# EAGLE design Lavadora (EAGLE 9.6.2)
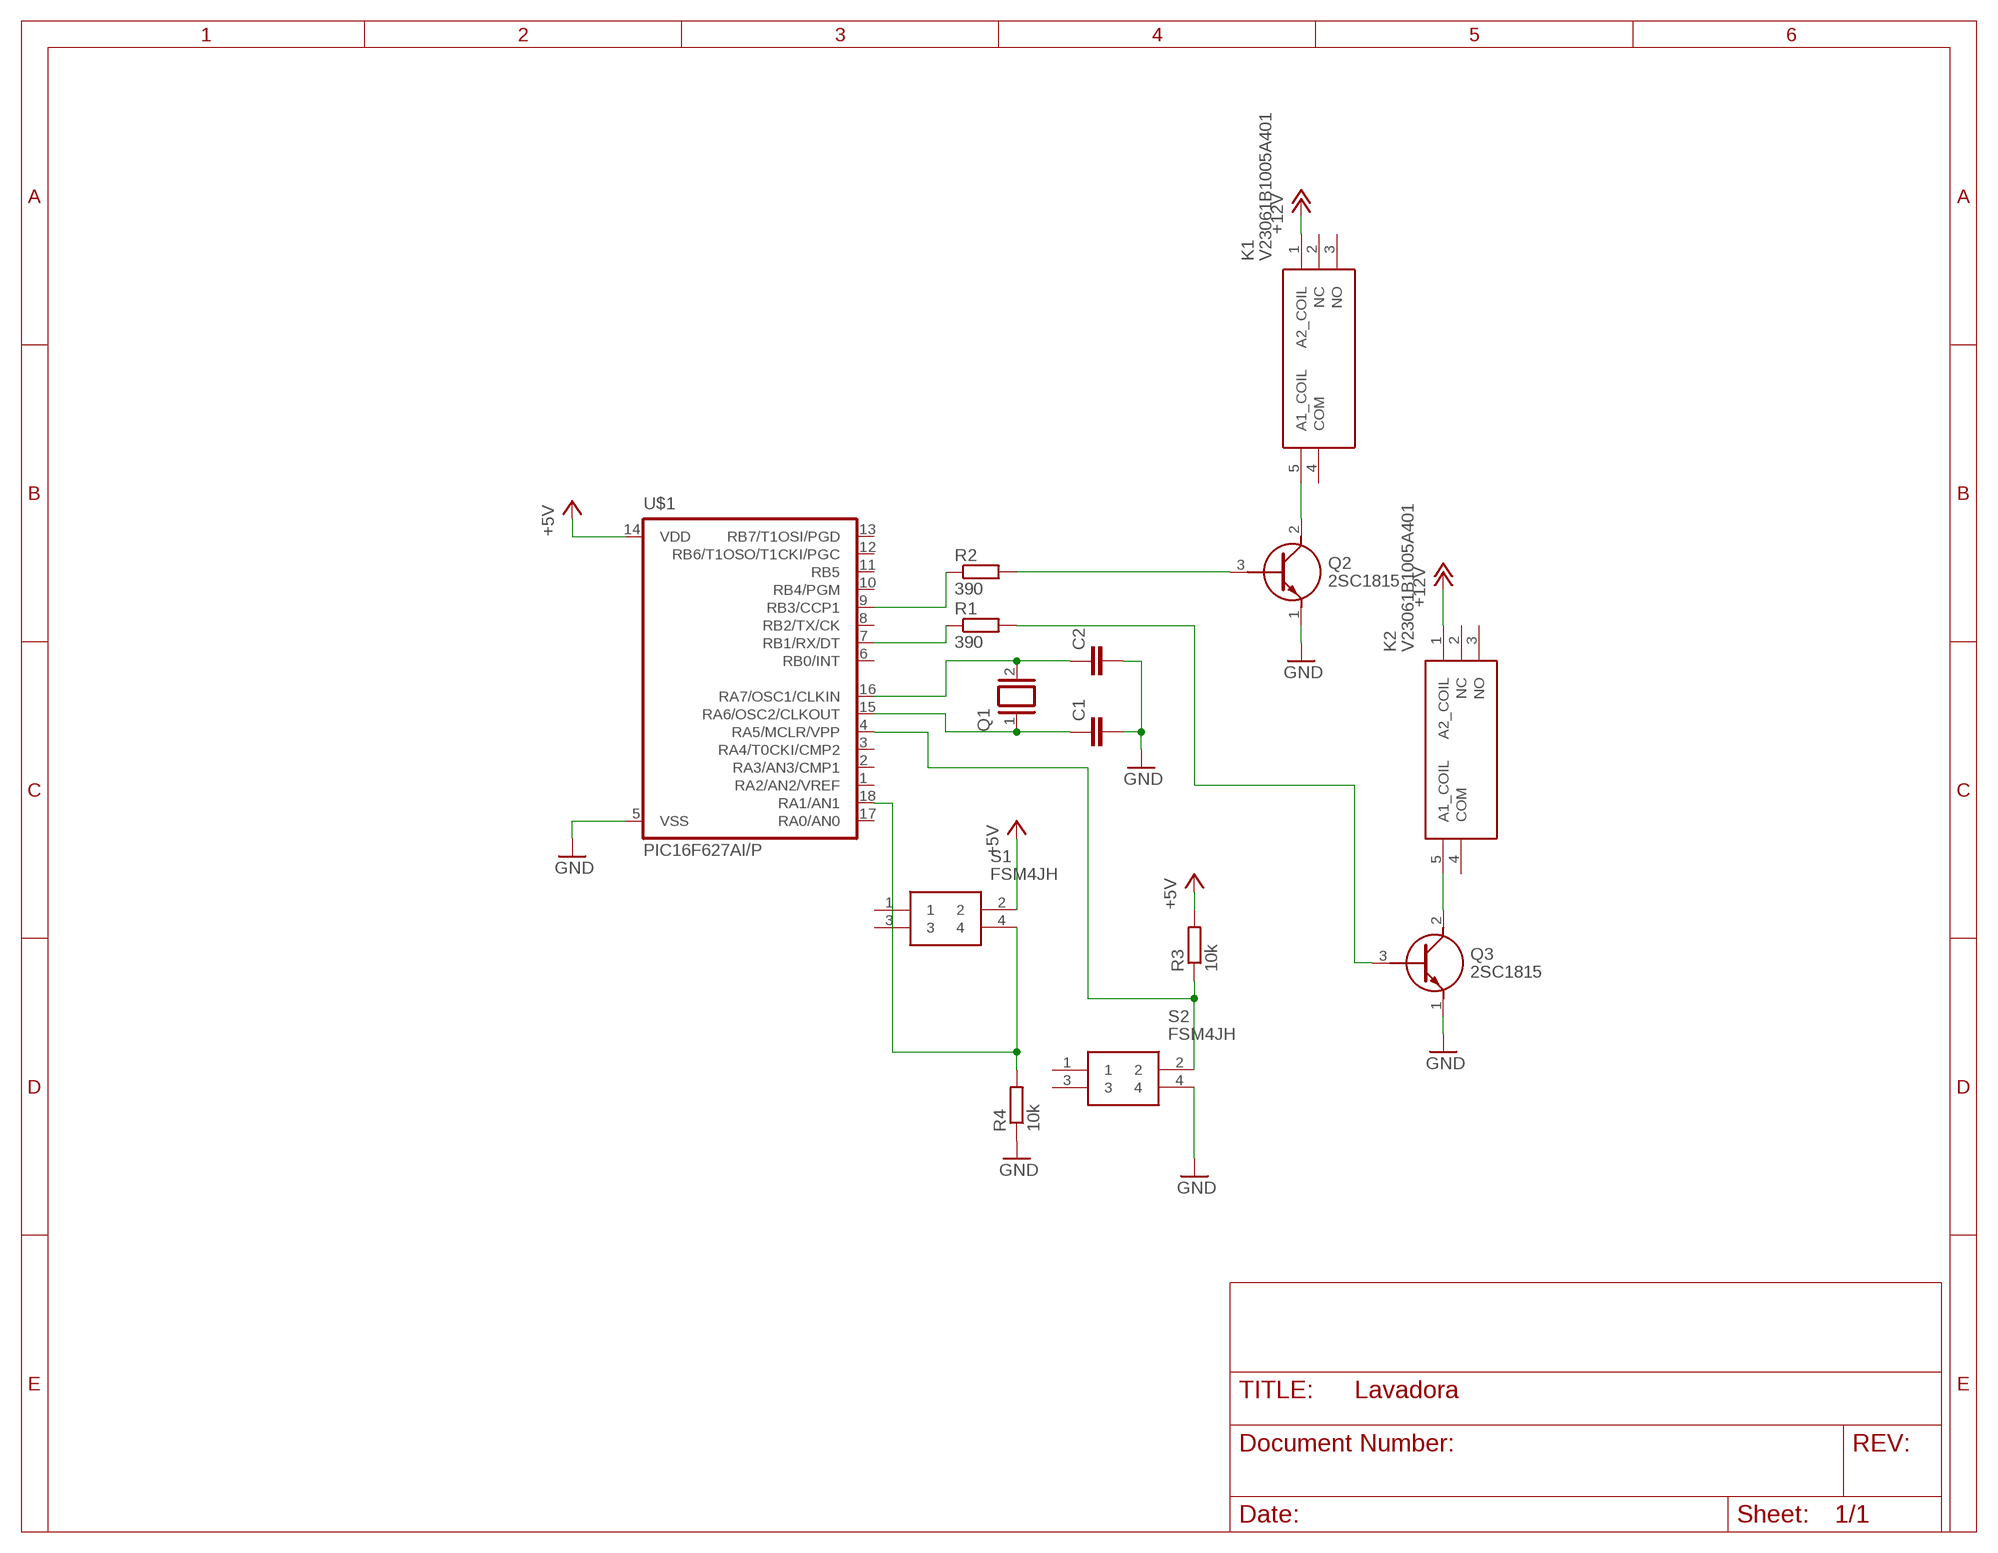
[diagram p0: schematic, sheet 1]

## Parts
C1  C-EU025-025X050  [C025-025X050]
C2  C-EU025-025X050  [C025-025X050]
K1  V23061B1005A401  [V23061B1005A401]
K2  V23061B1005A401  [V23061B1005A401]
Q1  XTAL  [Q]
Q2  2SC1815  [CS_TO-92]
Q3  2SC1815  [CS_TO-92]
R1  390  R-EU_0207/10  [0207/10]
R2  390  R-EU_0207/10  [0207/10]
R3  10k  R-EU_0207/10  [0207/10]
R4  10k  R-EU_0207/10  [0207/10]
S1  FSM4JH  [FSM4JH]
S2  FSM4JH  [FSM4JH]
U$1  PIC16F627AI/P  [DIL18]

## Nets
+5V: R3.2 S1.2 U$1.14(VDD)
+12V: K1.1(A2_COIL) K2.1(A2_COIL)
GND: C1.2 C2.2 Q2.1(E) Q3.1(E) R4.1 S2.4 U$1.5(VSS)
N$1: C1.1 Q1.1 U$1.15(RA6/OSC2/CLKOUT)
N$2: C2.1 Q1.2 U$1.16(RA7/OSC1/CLKIN)
N$3: R1.1 U$1.7(RB1/RX/DT)
N$4: R2.1 U$1.9(RB3/CCP1)
N$5: Q2.3(B) R2.2
N$6: K1.5(A1_COIL) Q2.2(C)
N$7: K2.5(A1_COIL) Q3.2(C)
N$8: Q3.3(B) R1.2
N$9: R3.1 S2.2 U$1.4(RA5/MCLR/VPP)
N$10: R4.2 S1.4 U$1.18(RA1/AN1)
Unconnected: K1.2(NC) K1.3(NO) K1.4(COM) K2.2(NC) K2.3(NO) K2.4(COM) S1.1 S1.3 S2.1 S2.3 U$1.1(RA2/AN2/VREF) U$1.2(RA3/AN3/CMP1) U$1.3(RA4/T0CKI/CMP2) U$1.6(RB0/INT) U$1.8(RB2/TX/CK) U$1.10(RB4/PGM) U$1.11(RB5) U$1.12(RB6/T1OSO/T1CKI/PGC) U$1.13(RB7/T1OSI/PGD) U$1.17(RA0/AN0)

## Library data of the parts
C1 C2 = rcl:C-EU: CAPACITOR, European symbol; SPICEPREFIX: C
K1 K2 = SamacSys_Parts:V23061B1005A401: RELAY 12VDC Source: Datasheet <https://componentsearchengine.com/Datasheets/1/V23061B1005A401.pdf>; DESCRIPTION: RELAY 12VDC; HEIGHT: mm; MANUFACTURER_NAME: TE Connectivity; MANUFACTURER_PART_NUMBER: V23061B1005A401; MOUSER_PART_NUMBER: 655-V23061B1005A401; MOUSER_PRICE-STOCK: https://www.mouser.com/Search/Refine.aspx?Keyword=655-V23061B1005A401
Q1 = special:XTAL: CRYSTAL
Q2 Q3 = 2SC1815:2SC1815: Bipolar Transistors - BJT 60Vcbo 50Vceo 5.0V 150mA 400mA 400mW Source: Datasheet <https://componentsearchengine.com/Datasheets/1/2SC1815.pdf>; DESCRIPTION: Bipolar Transistors - BJT 60Vcbo 50Vceo 5.0V 150mA 400mA 400mW; HEIGHT: mm; MANUFACTURER_NAME: Central Semiconductor; MANUFACTURER_PART_NUMBER: 2SC1815; MOUSER_PART_NUMBER: 610-2SC1815; MOUSER_PRICE-STOCK: https://www.mouser.com/Search/Refine.aspx?Keyword=610-2SC1815
R1-R4 = rcl:R-EU_: RESISTOR, European symbol; SPICEPREFIX: R
S1 S2 = FSM4JH:FSM4JH: 6x6mm tactile switch,5mm H 1.6N Black Button Tactile Switch, SPST-NO 50 mA@ 24 V dc 1.4mm Source: Datasheet <http://www.te.com/commerce/DocumentDelivery/DDEController?Action=showdoc&DocId=Customer Drawing1825910C9pdfEnglishENG_CD_1825910_C9.pdf1825910-6>; DESCRIPTION: 6x6mm tactile switch,5mm H 1.6N Black Button Tactile Switch, SPST-NO 50 mA@ 24 V dc 1.4mm; HEIGHT: mm; MANUFACTURER_NAME: TE Connectivity; MANUFACTURER_PART_NUMBER: FSM4JH; MOUSER_PART_NUMBER: 506-FSM4JH; MOUSER_PRICE-STOCK: https://www.mouser.co.uk/ProductDetail/TE-Connectivity-Alcoswitch/FSM4JH?qs=g%252BEszo6zu8OwVWrHD2r3Rw%3D%3D
U$1 = microchip-4:PIC16F627*: MICROCONTROLLER PIC16F627(A) 16 I/O One 16-bit timer (TMR0) Two 8-bit timer (TMR0) Two comparators USART CCP/PWM Precision 4 MHz internal oscillator 1k Program Flash memory 224 bytes SRAM 128 bytes EEPROM

## Board
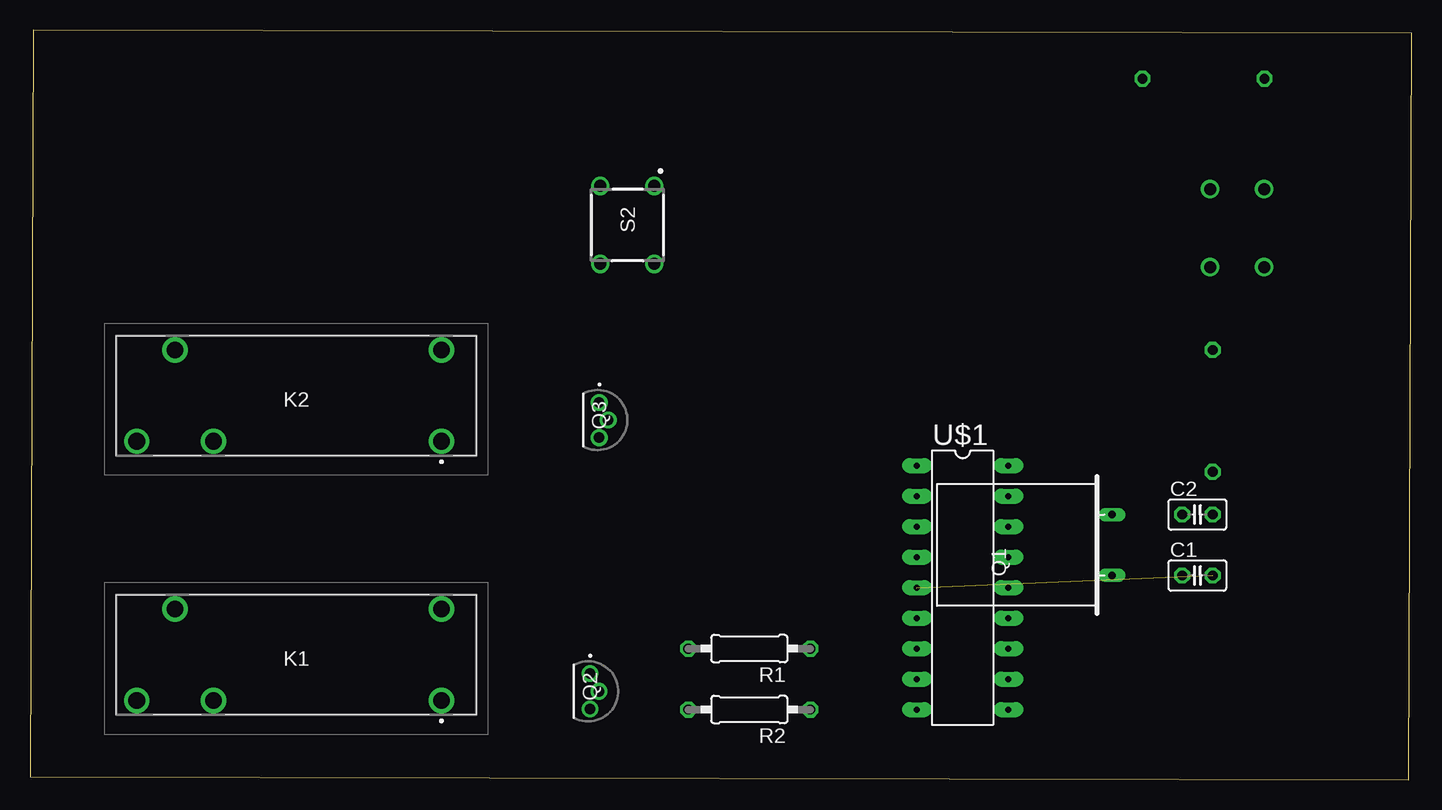
[diagram p1: board, top side]
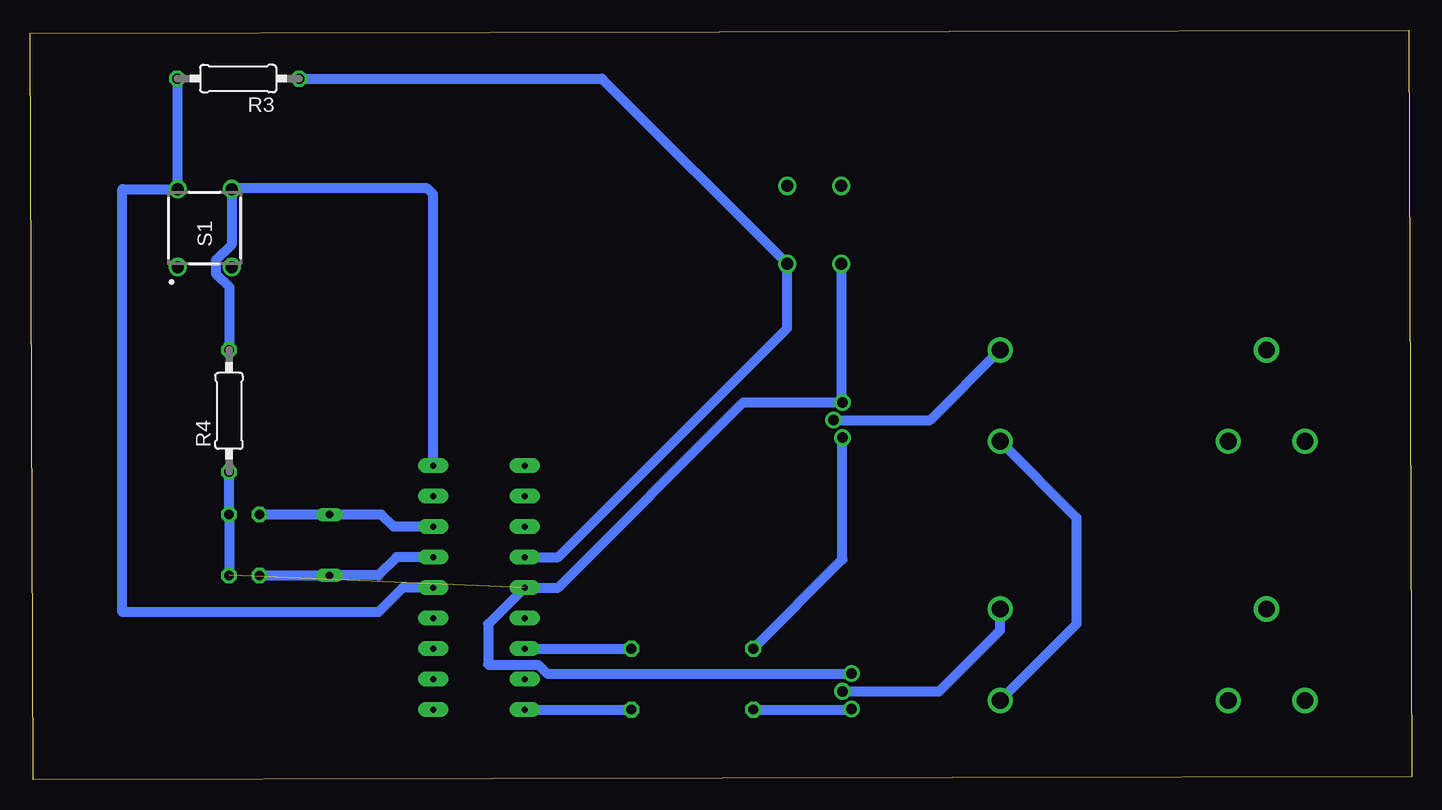
[diagram p2: board, bottom side, seen from below]

Size 115.14 x 62.47 mm. Coordinates in mm from the lower left corner, seen from the top.
Outline: 0,0.25 114.88,0 115.14,62.22 0.25,62.47 0,0.25
Copper layers (1*16): Top 0.035mm / dielectric 1.5mm / Bottom 0.035mm
Design rules "default": minimum track width 6mil, minimum drill 0.35mm, track to track 6mil, track to pad 6mil, pad to pad 6mil, via to via 6mil, smd to smd 6mil, copper to edge 40mil, drill to drill 6mil, minimum pad ring 10mil, minimum via ring 8mil, stop-mask expansion 4mil, vias tented up to drill 0mil, thermal gap 10mil

### Footprints (pad centres in the part's own frame; a part is rotated, then mirrored left to right if it is on the bottom)
C025-025X050 = drill 0.813 octagon: 1 -1.27,0; 2 1.27,0
V23061B1005A401 = drill 1.4 pad 2.1: 1 0,0; 2 19,0; 3 25.4,0; 4 22.2,-7.62; 5 0,-7.62
Q = drill 0.61 long: 1 -2.54,-7.62; 2 2.54,-7.62
CS_TO-92 = drill 0.88 pad 1.35: 1 -1.47,-2.35 | drill 0.88 pad 1.4: 2 0,-1.6; 3 1.47,-2.35
0207/10 = drill 0.813 octagon: 1 -5.08,0; 2 5.08,0
FSM4JH = drill 1 pad 1.5: 1 -3.25,2.25; 2 3.25,2.25; 3 -3.25,-2.25; 4 3.25,-2.25
DIL18 = drill 0.5 pad 1.27 long: 1 -10.16,-3.81; 2 -7.62,-3.81; 3 -5.08,-3.81; 4 -2.54,-3.81; 5 0,-3.81; 6 2.54,-3.81; 7 5.08,-3.81; 8 7.62,-3.81; 9 10.16,-3.81; 10 10.16,3.81; 11 7.62,3.81; 12 5.08,3.81; 13 2.54,3.81; 14 0,3.81; 15 -2.54,3.81; 16 -5.08,3.81; 17 -7.62,3.81; 18 -10.16,3.81

### Placement (x,y rotation side)
C1  97.28,17.02 0 top
C2  97.28,22.1 0 top
K1  34.29,6.6 180 top
K2  34.29,28.19 180 top
Q1  82.55,19.56 90 top
Q2  49.02,7.37 270 top
Q3  49.78,29.97 270 top
R1  59.94,10.92 180 top
R2  59.94,5.84 180 top
R3  97.79,58.42 180 bottom
R4  98.55,30.73 90 bottom
S1  100.58,45.97 90 bottom
S2  49.78,46.23 270 top
U$1  77.72,16 270 top

### Tracks (layer width: path | path; a pad name or v marks a point on that pad's centre or on a via)
+5V
  Bottom 0.813: U$1.14 84.07,16 86.11,13.97 107.44,13.97 107.44,49.22 S1.2 102.83,58.38 R3.2
+12V
  Bottom 0.813: K2.1 27.94,21.84 27.94,12.95 K1.1
GND  (1 unrouted)
  Bottom 0.813: Q2.1 72.05,8.84 72.78,9.58 76.89,9.58 76.96,9.65 76.96,12.95 U$1.5 71.12,16 55.68,31.44 Q3.1 47.53,31.54 S2.4 | C1.2 C2.2 R4.1
N$1
  Bottom 0.813: U$1.15 84.58,18.54 86.11,17.02 Q1.1 C1.1
N$2
  Bottom 0.813: U$1.16 84.84,21.08 85.85,22.1 Q1.2 C2.1
N$3
  Bottom 0.813: U$1.7 R1.1
N$4
  Bottom 0.813: U$1.9 R2.1
N$5
  Bottom 0.813: R2.2 46.73,5.84 Q2.3
N$6
  Bottom 0.813: Q2.2 39.37,7.37 34.29,12.45 K1.5
N$7
  Bottom 0.813: K2.5 40.13,29.97 Q3.2
N$8
  Bottom 0.813: R1.2 47.43,18.35 Q3.3
N$9
  Bottom 0.813: R3.1 67.48,58.42 S2.2 52.03,37.63 71.12,18.54 U$1.4
N$10
  Bottom 0.813: U$1.18 81.53,48.77 82.04,49.28 98.28,49.28 S1.4 98.33,44.58 99.65,43.27 99.65,42.18 98.55,41.09 R4.2